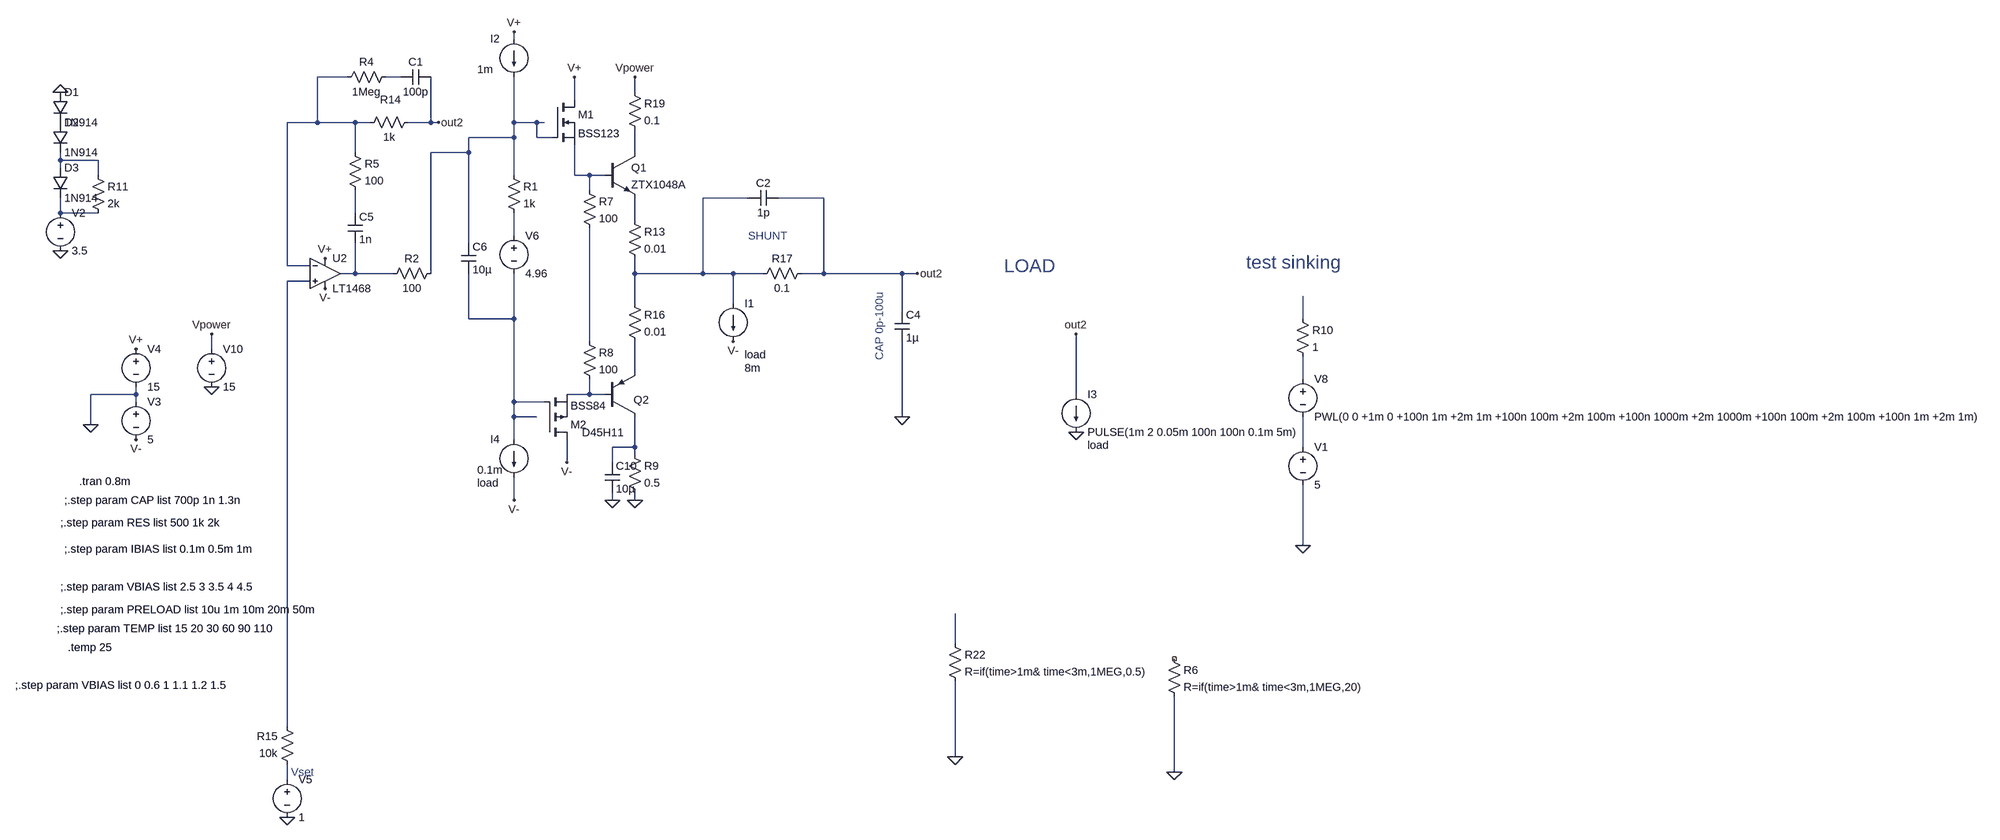
[diagram p0: schematic super_fast_push_pull_autobias.asc]
super_fast_push_pull_autobias.asc, the LTspice schematic file:
Version 4
SHEET 1 8456 1444
WIRE 96 -288 96 -304
WIRE -256 -208 -320 -208
WIRE -144 -208 -176 -208
WIRE 352 -176 352 -208
WIRE 224 -160 224 -208
WIRE -320 -112 -320 -208
WIRE -320 -112 -384 -112
WIRE -240 -112 -320 -112
WIRE -208 -112 -240 -112
WIRE -80 -112 -80 -208
WIRE -80 -112 -128 -112
WIRE -64 -112 -80 -112
WIRE 96 -112 96 -208
WIRE 144 -112 96 -112
WIRE 160 -112 144 -112
WIRE 96 -80 96 -112
WIRE 96 -80 0 -80
WIRE 144 -80 144 -112
WIRE 176 -80 144 -80
WIRE -240 -48 -240 -112
WIRE 0 -48 0 -80
WIRE 0 -48 -80 -48
WIRE 352 -48 352 -96
WIRE -864 -32 -864 -48
WIRE -784 -32 -864 -32
WIRE -864 -16 -864 -32
WIRE -784 0 -784 -32
WIRE 96 0 96 -80
WIRE 224 0 224 -64
WIRE 256 0 224 0
WIRE 288 0 256 0
WIRE 256 32 256 0
WIRE 592 48 496 48
WIRE 752 48 656 48
WIRE -864 80 -864 48
WIRE -784 80 -864 80
WIRE -240 80 -240 32
WIRE 352 96 352 48
WIRE 96 128 96 80
WIRE 0 144 0 -48
WIRE -384 192 -384 -112
WIRE -336 192 -384 192
WIRE -240 208 -240 144
WIRE -240 208 -272 208
WIRE -160 208 -240 208
WIRE -80 208 -80 -48
WIRE 352 208 352 176
WIRE 496 208 496 48
WIRE 496 208 352 208
WIRE 560 208 496 208
WIRE 624 208 560 208
WIRE 752 208 752 48
WIRE 752 208 704 208
WIRE 976 208 752 208
WIRE 1008 208 976 208
WIRE -336 224 -384 224
WIRE 352 272 352 208
WIRE 560 272 560 208
WIRE 976 288 976 208
WIRE 0 304 0 208
WIRE 96 304 96 208
WIRE 96 304 0 304
WIRE 1824 304 1824 256
WIRE 256 352 256 112
WIRE -544 368 -544 336
WIRE 352 416 352 352
WIRE 1824 432 1824 384
WIRE -704 464 -704 448
WIRE -704 464 -800 464
WIRE 256 464 256 432
WIRE 256 464 208 464
WIRE 288 464 256 464
WIRE 1344 464 1344 336
WIRE -704 480 -704 464
WIRE 96 480 96 304
WIRE 160 480 96 480
WIRE 96 512 96 480
WIRE 144 512 96 512
WIRE 976 512 976 352
WIRE -800 528 -800 464
WIRE 96 560 96 512
WIRE 352 576 352 512
WIRE 352 576 304 576
WIRE 1824 576 1824 512
WIRE 352 592 352 576
WIRE 208 608 208 560
WIRE 304 608 304 576
WIRE 96 688 96 640
WIRE 304 688 304 672
WIRE 352 688 352 672
WIRE 1824 784 1824 656
WIRE 1088 992 1088 928
WIRE -384 1168 -384 224
WIRE 1088 1232 1088 1072
WIRE 1552 1264 1552 1104
WIRE -384 1280 -384 1248
FLAG -800 528 0
FLAG -704 368 V+
FLAG -704 560 V-
FLAG -304 176 V+
FLAG -304 240 V-
FLAG 1008 208 out2
FLAG 1088 1232 0
FLAG 976 512 0
FLAG 1824 784 0
FLAG -384 1360 0
FLAG 1344 336 out2
FLAG 560 352 V-
FLAG -64 -112 out2
FLAG 352 688 0
FLAG 208 608 V-
FLAG -544 336 Vpower
FLAG -544 448 0
FLAG 352 -208 Vpower
FLAG 224 -208 V+
FLAG 96 -304 V+
FLAG 1552 1264 0
FLAG 1344 544 0
FLAG 304 688 0
FLAG -864 160 0
FLAG -864 -176 0
FLAG 96 688 V-
DATAFLAG 896 208 ""
DATAFLAG 400 576 ""
SYMBOL voltage -704 464 R0
WINDOW 123 0 0 Left 0
WINDOW 39 0 0 Left 0
SYMATTR InstName V3
SYMATTR Value 5
SYMBOL voltage -704 352 R0
WINDOW 123 0 0 Left 0
WINDOW 39 0 0 Left 0
SYMATTR InstName V4
SYMATTR Value 15
SYMBOL cap -256 80 R0
SYMATTR InstName C5
SYMATTR Value 1n
SYMBOL res -112 -128 R90
WINDOW 0 -16 53 VBottom 2
WINDOW 3 32 56 VTop 2
SYMATTR InstName R14
SYMATTR Value 1k
SYMBOL res -368 1264 R180
WINDOW 0 36 76 Left 2
WINDOW 3 36 40 Left 2
SYMATTR InstName R15
SYMATTR Value 10k
SYMBOL res 608 224 R270
WINDOW 0 32 56 VTop 2
WINDOW 3 0 56 VBottom 2
SYMATTR InstName R17
SYMATTR Value 0.1
SYMBOL res 1072 976 R0
SYMATTR InstName R22
SYMATTR Value R=if(time>1m& time<3m,1MEG,0.5)
SYMBOL cap 960 288 R0
SYMATTR InstName C4
SYMATTR Value 1µ
SYMATTR SpiceLine Rser=0.1
SYMBOL voltage 1824 416 R0
WINDOW 123 0 0 Left 0
WINDOW 39 0 0 Left 0
SYMATTR InstName V8
SYMATTR Value PWL(0 0 +1m 0 +100n 1m +2m 1m +100n 100m +2m 100m +100n 1000m +2m 1000m +100n 100m +2m 100m +100n 1m +2m 1m)
SYMBOL res 1808 288 R0
SYMATTR InstName R10
SYMATTR Value 1
SYMBOL voltage -384 1264 R0
WINDOW 123 0 0 Left 0
WINDOW 39 0 0 Left 0
SYMATTR InstName V5
SYMATTR Value 1
SYMBOL LT1468 -304 144 R0
SYMATTR InstName U2
SYMBOL res -64 192 R90
WINDOW 0 0 56 VBottom 2
WINDOW 3 32 56 VTop 2
SYMATTR InstName R2
SYMATTR Value 100
SYMBOL voltage 1824 560 R0
WINDOW 123 0 0 Left 0
WINDOW 39 0 0 Left 0
SYMATTR InstName V1
SYMATTR Value 5
SYMBOL current 560 272 R0
WINDOW 3 24 136 Left 2
WINDOW 123 0 0 Left 0
WINDOW 39 24 108 Left 2
SYMATTR Value 8m
SYMATTR SpiceLine load
SYMATTR InstName I1
SYMBOL npn 288 -48 R0
SYMATTR InstName Q1
SYMATTR Value ZTX1048A
SYMBOL nmos 176 -160 R0
SYMATTR InstName M1
SYMATTR Value BSS123
SYMBOL pnp 288 512 M180
WINDOW 0 61 36 Left 2
WINDOW 3 -48 -33 Left 2
SYMATTR InstName Q2
SYMATTR Value D45H11
SYMBOL pmos 160 560 M180
SYMATTR InstName M2
SYMATTR Value BSS84
SYMBOL voltage -544 352 R0
WINDOW 123 0 0 Left 0
WINDOW 39 0 0 Left 0
SYMATTR InstName V10
SYMATTR Value 15
SYMBOL res -256 -64 R0
SYMATTR InstName R5
SYMATTR Value 100
SYMBOL current 96 -288 R0
WINDOW 0 -50 -1 Left 2
WINDOW 3 -78 64 Left 2
WINDOW 123 0 0 Left 0
WINDOW 39 0 0 Left 0
SYMATTR InstName I2
SYMATTR Value 1m
SYMBOL res 1536 1008 R0
SYMATTR InstName R6
SYMATTR Value R=if(time>1m& time<3m,1MEG,20)
SYMBOL current 1344 464 R0
WINDOW 123 0 0 Left 0
WINDOW 39 24 108 Left 2
SYMATTR SpiceLine load
SYMATTR InstName I3
SYMATTR Value PULSE(1m 2 0.05m 100n 100n 0.1m 5m)
SYMBOL cap -80 -224 R90
WINDOW 0 0 32 VBottom 2
WINDOW 3 32 32 VTop 2
SYMATTR InstName C1
SYMATTR Value 100p
SYMBOL res -160 -224 R90
WINDOW 0 0 56 VBottom 2
WINDOW 3 32 56 VTop 2
SYMATTR InstName R4
SYMATTR Value 1Meg
SYMBOL res 240 16 R0
SYMATTR InstName R7
SYMATTR Value 100
SYMBOL res 240 336 R0
SYMATTR InstName R8
SYMATTR Value 100
SYMBOL cap 656 32 R90
WINDOW 0 0 32 VBottom 2
WINDOW 3 32 32 VTop 2
SYMATTR InstName C2
SYMATTR Value 1p
SYMBOL res 336 576 R0
SYMATTR InstName R9
SYMATTR Value 0.5
SYMBOL res 336 80 R0
SYMATTR InstName R13
SYMATTR Value 0.01
SYMBOL res 336 -192 R0
SYMATTR InstName R19
SYMATTR Value 0.1
SYMBOL res 336 256 R0
SYMATTR InstName R16
SYMATTR Value 0.01
SYMBOL cap 288 608 R0
SYMATTR InstName C10
SYMATTR Value 10µ
SYMBOL voltage -864 64 R0
WINDOW 123 0 0 Left 0
WINDOW 39 0 0 Left 0
SYMATTR InstName V2
SYMATTR Value 3.5
SYMBOL cap -16 144 R0
SYMATTR InstName C6
SYMATTR Value 10µ
SYMBOL diode -880 -176 R0
SYMATTR InstName D1
SYMATTR Value 1N914
SYMBOL diode -880 -112 R0
SYMATTR InstName D2
SYMATTR Value 1N914
SYMBOL diode -880 -16 R0
SYMATTR InstName D3
SYMATTR Value 1N914
SYMBOL res -800 -16 R0
SYMATTR InstName R11
SYMATTR Value 2k
SYMBOL current 96 560 R0
WINDOW 0 -50 -1 Left 2
WINDOW 3 -78 64 Left 2
WINDOW 123 0 0 Left 0
WINDOW 39 -78 92 Left 2
SYMATTR InstName I4
SYMATTR Value 0.1m
SYMATTR SpiceLine load
SYMBOL voltage 96 112 R0
WINDOW 123 0 0 Left 0
WINDOW 39 0 0 Left 0
SYMATTR InstName V6
SYMATTR Value 4.96
SYMBOL res 80 -16 R0
SYMATTR InstName R1
SYMATTR Value 1k
TEXT -824 648 Left 2 !.tran 0.8m
TEXT -376 1264 Left 2 ;Vset
TEXT 592 128 Left 2 ;SHUNT
TEXT 1192 192 Left 4 ;LOAD
TEXT 928 392 VLeft 2 ;CAP 0p-100u
TEXT 1704 184 Left 4 ;test sinking
TEXT -856 688 Left 2 !;.step param CAP list 700p 1n 1.3n
TEXT -864 736 Left 2 !;.step param RES list 500 1k 2k
TEXT -856 792 Left 2 !;.step param IBIAS list 0.1m 0.5m 1m
TEXT -864 872 Left 2 !;.step param VBIAS list 2.5 3 3.5 4 4.5
TEXT -864 920 Left 2 !;.step param PRELOAD list 10u 1m 10m 20m 50m
TEXT -960 1080 Left 2 !;.step param VBIAS list 0 0.6 1 1.1 1.2 1.5
TEXT -848 1000 Left 2 !.temp 25
TEXT -872 960 Left 2 !;.step param TEMP list 15 20 30 60 90 110

The netlist it stands for:
* super_fast_push_pull_autobias.asc
V3 0 V- 5
V4 V+ 0 15
C5 N009 N012 1n
R14 out2 N001 1k
R15 N023 N013 10k
R17 N007 out2 0.1
R22 N022 0 R=if(time>1m& time<3m,1MEG,0.5)
C4 out2 0 1µ Rser=0.1
V8 N018 N021 PWL(0 0 +1m 0 +100n 1m +2m 1m +100n 100m +2m 100m +100n 1000m +2m 1000m +100n 100m +2m 100m +100n 1m +2m 1m)
R10 N015 N018 1
V5 N023 0 1
* U2: LT1468 (symbol LT1468 not available, pins judged from their places): In+=N013 In-=N001 V+=V+ V-=V- OUT=N012
R2 N003 N012 100
V1 N021 0 5
I1 N007 V- 8m load
Q1 N004 N006 N010 0 ZTX1048A
M1 V+ N003 N006 N006 BSS123
Q2 N020 N019 N017 0 D45H11
M2 V- N014 N019 N019 BSS84
V10 Vpower 0 15
R5 N001 N009 100
I2 V+ N003 1m
R6 NC_01 0 R=if(time>1m& time<3m,1MEG,20)
I3 out2 0 PULSE(1m 2 0.05m 100n 100n 0.1m 5m) load
C1 out2 N002 100p
R4 N002 N001 1Meg
R7 N006 N016 100
R8 N016 N019 100
C2 out2 N007 1p
R9 N020 0 0.5
R13 N010 N007 0.01
R19 Vpower N004 0.1
R16 N007 N017 0.01
C10 N020 0 10µ
V2 N008 0 3.5
C6 N003 N014 10µ
D1 0 P001 1N914
D2 P001 N005 1N914
D3 N005 N008 1N914
R11 N005 N008 2k
I4 N014 V- 0.1m load
V6 N011 N014 4.96
R1 N003 N011 1k
.model D D
.lib standard.dio
.model NPN NPN
.model PNP PNP
.lib standard.bjt
.model NMOS NMOS
.model PMOS PMOS
.lib standard.mos
.tran 0.8m
* Vset
* SHUNT
* LOAD
* CAP 0p-100u
* test sinking
;.step param CAP list 700p 1n 1.3n
;.step param RES list 500 1k 2k
;.step param IBIAS list 0.1m 0.5m 1m
;.step param VBIAS list 2.5 3 3.5 4 4.5
;.step param PRELOAD list 10u 1m 10m 20m 50m
;.step param VBIAS list 0 0.6 1 1.1 1.2 1.5
.temp 25
;.step param TEMP list 15 20 30 60 90 110
.backanno
.end